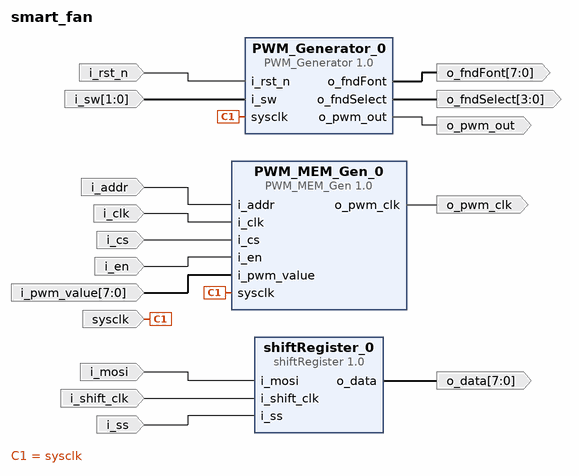
[diagram p0: block diagram of the top level]
# Vivado block design smart_fan, xc7a35tcpg236-1, Vivado 2020.2
create_bd_design smart_fan

create_bd_port -dir I i_addr
create_bd_port -dir I -type clk i_clk
create_bd_port -dir I i_cs
create_bd_port -dir I i_en
create_bd_port -dir I -from 7 -to 0 i_pwm_value
create_bd_port -dir O -type clk o_pwm_clk
create_bd_port -dir I sysclk
create_bd_port -dir I -type rst i_rst_n
create_bd_port -dir O -from 7 -to 0 o_fndFont
create_bd_port -dir O -from 3 -to 0 o_fndSelect
create_bd_port -dir O o_pwm_out
create_bd_port -dir I i_mosi
create_bd_port -dir I -type clk i_shift_clk
create_bd_port -dir I i_ss
create_bd_port -dir O -from 7 -to 0 o_data
create_bd_port -dir I -from 1 -to 0 i_sw

create_bd_cell -type ip -vlnv xilinx.com:user:PWM_MEM_Gen:1.0 PWM_MEM_Gen_0
create_bd_cell -type ip -vlnv xilinx.com:user:PWM_Generator:1.0 PWM_Generator_0
create_bd_cell -type ip -vlnv xilinx.com:user:shiftRegister:1.0 shiftRegister_0

# ---- connections ----

connect_bd_net -net i_addr_0_1 [get_bd_ports i_addr] [get_bd_pins PWM_MEM_Gen_0/i_addr]
connect_bd_net -net i_clk_0_1 [get_bd_ports i_clk] [get_bd_pins PWM_MEM_Gen_0/i_clk]
connect_bd_net -net i_cs_0_1 [get_bd_ports i_cs] [get_bd_pins PWM_MEM_Gen_0/i_cs]
connect_bd_net -net i_en_0_1 [get_bd_ports i_en] [get_bd_pins PWM_MEM_Gen_0/i_en]
connect_bd_net -net i_pwm_value_0_1 [get_bd_ports i_pwm_value] [get_bd_pins PWM_MEM_Gen_0/i_pwm_value]
connect_bd_net [get_bd_pins PWM_MEM_Gen_0/o_pwm_clk] [get_bd_ports o_pwm_clk]
connect_bd_net -net sysclk_0_1 [get_bd_ports sysclk] [get_bd_pins PWM_MEM_Gen_0/sysclk] [get_bd_pins PWM_Generator_0/sysclk]
connect_bd_net -net i_rst_n_0_1 [get_bd_ports i_rst_n] [get_bd_pins PWM_Generator_0/i_rst_n]
connect_bd_net [get_bd_pins PWM_Generator_0/o_fndFont] [get_bd_ports o_fndFont]
connect_bd_net [get_bd_pins PWM_Generator_0/o_fndSelect] [get_bd_ports o_fndSelect]
connect_bd_net [get_bd_pins PWM_Generator_0/o_pwm_out] [get_bd_ports o_pwm_out]
connect_bd_net -net i_mosi_0_1 [get_bd_ports i_mosi] [get_bd_pins shiftRegister_0/i_mosi]
connect_bd_net -net i_shift_clk_0_1 [get_bd_ports i_shift_clk] [get_bd_pins shiftRegister_0/i_shift_clk]
connect_bd_net -net i_ss_0_1 [get_bd_ports i_ss] [get_bd_pins shiftRegister_0/i_ss]
connect_bd_net [get_bd_pins shiftRegister_0/o_data] [get_bd_ports o_data]
connect_bd_net -net i_sw_0_1 [get_bd_ports i_sw] [get_bd_pins PWM_Generator_0/i_sw]

validate_bd_design
save_bd_design
